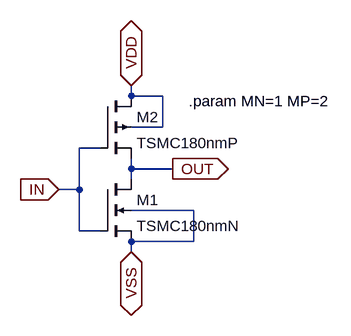
[diagram p0: schematic tutorial_inv.asc]
tutorial_inv.asc, the LTspice schematic file:
Version 4
SHEET 1 880 680
WIRE 224 -16 224 -32
WIRE 272 -16 224 -16
WIRE 272 32 272 -16
WIRE 272 32 224 32
WIRE 176 64 144 64
WIRE 224 96 224 80
WIRE 288 96 224 96
WIRE 224 112 224 96
WIRE 144 128 144 64
WIRE 144 128 112 128
WIRE 320 160 224 160
WIRE 144 192 144 128
WIRE 176 192 144 192
WIRE 320 208 320 160
WIRE 320 208 224 208
WIRE 224 224 224 208
FLAG 112 128 IN
IOPIN 112 128 In
FLAG 288 96 OUT
IOPIN 288 96 Out
FLAG 224 -32 VDD
IOPIN 224 -32 BiDir
FLAG 224 224 VSS
IOPIN 224 224 BiDir
SYMBOL nmos4 176 112 R0
SYMATTR InstName M1
SYMATTR Value TSMC180nmN
SYMATTR Value2 l=200nm w=300nm m={MN}
SYMBOL pmos4 176 -16 R0
SYMATTR InstName M2
SYMATTR Value TSMC180nmP
SYMATTR Value2 l=200nm w=300nm m={MP}
TEXT 312 -8 Left 2 !.param MN=1 MP=2

The netlist it stands for:
* tutorial_inv.asc
M1 OUT IN VSS VSS TSMC180nmN l=200nm w=300nm m={MN}
M2 VDD IN OUT VDD TSMC180nmP l=200nm w=300nm m={MP}
.model NMOS NMOS
.model PMOS PMOS
.lib standard.mos
.param MN=1 MP=2
.backanno
.end